# Altium schematic sheet 3-Sim Card.SchDoc
size 594 x 420 mm; SheetNumber: 3; SheetTotal: 7; PageSetup: Record=PageOptions|CenterHorizontal=False|CenterVertical=False|PrintScale=0.43|XCorrection=0.00|YCorrection=0.00|PrintKind=1|BorderSize=5000000|LeftOffset=0|BottomOffset=0|Orientation=2|PaperLength=5940|PaperWidth=4200|Scale=100|PaperSource=7|PrintQuality=-4|MediaType=1|DitherType=10|PaperKind=Personal. 1: 215,9 x 279,4 mm|PrintScaleMode=0; NumTotalFolhas: 7; NumFolha: 3
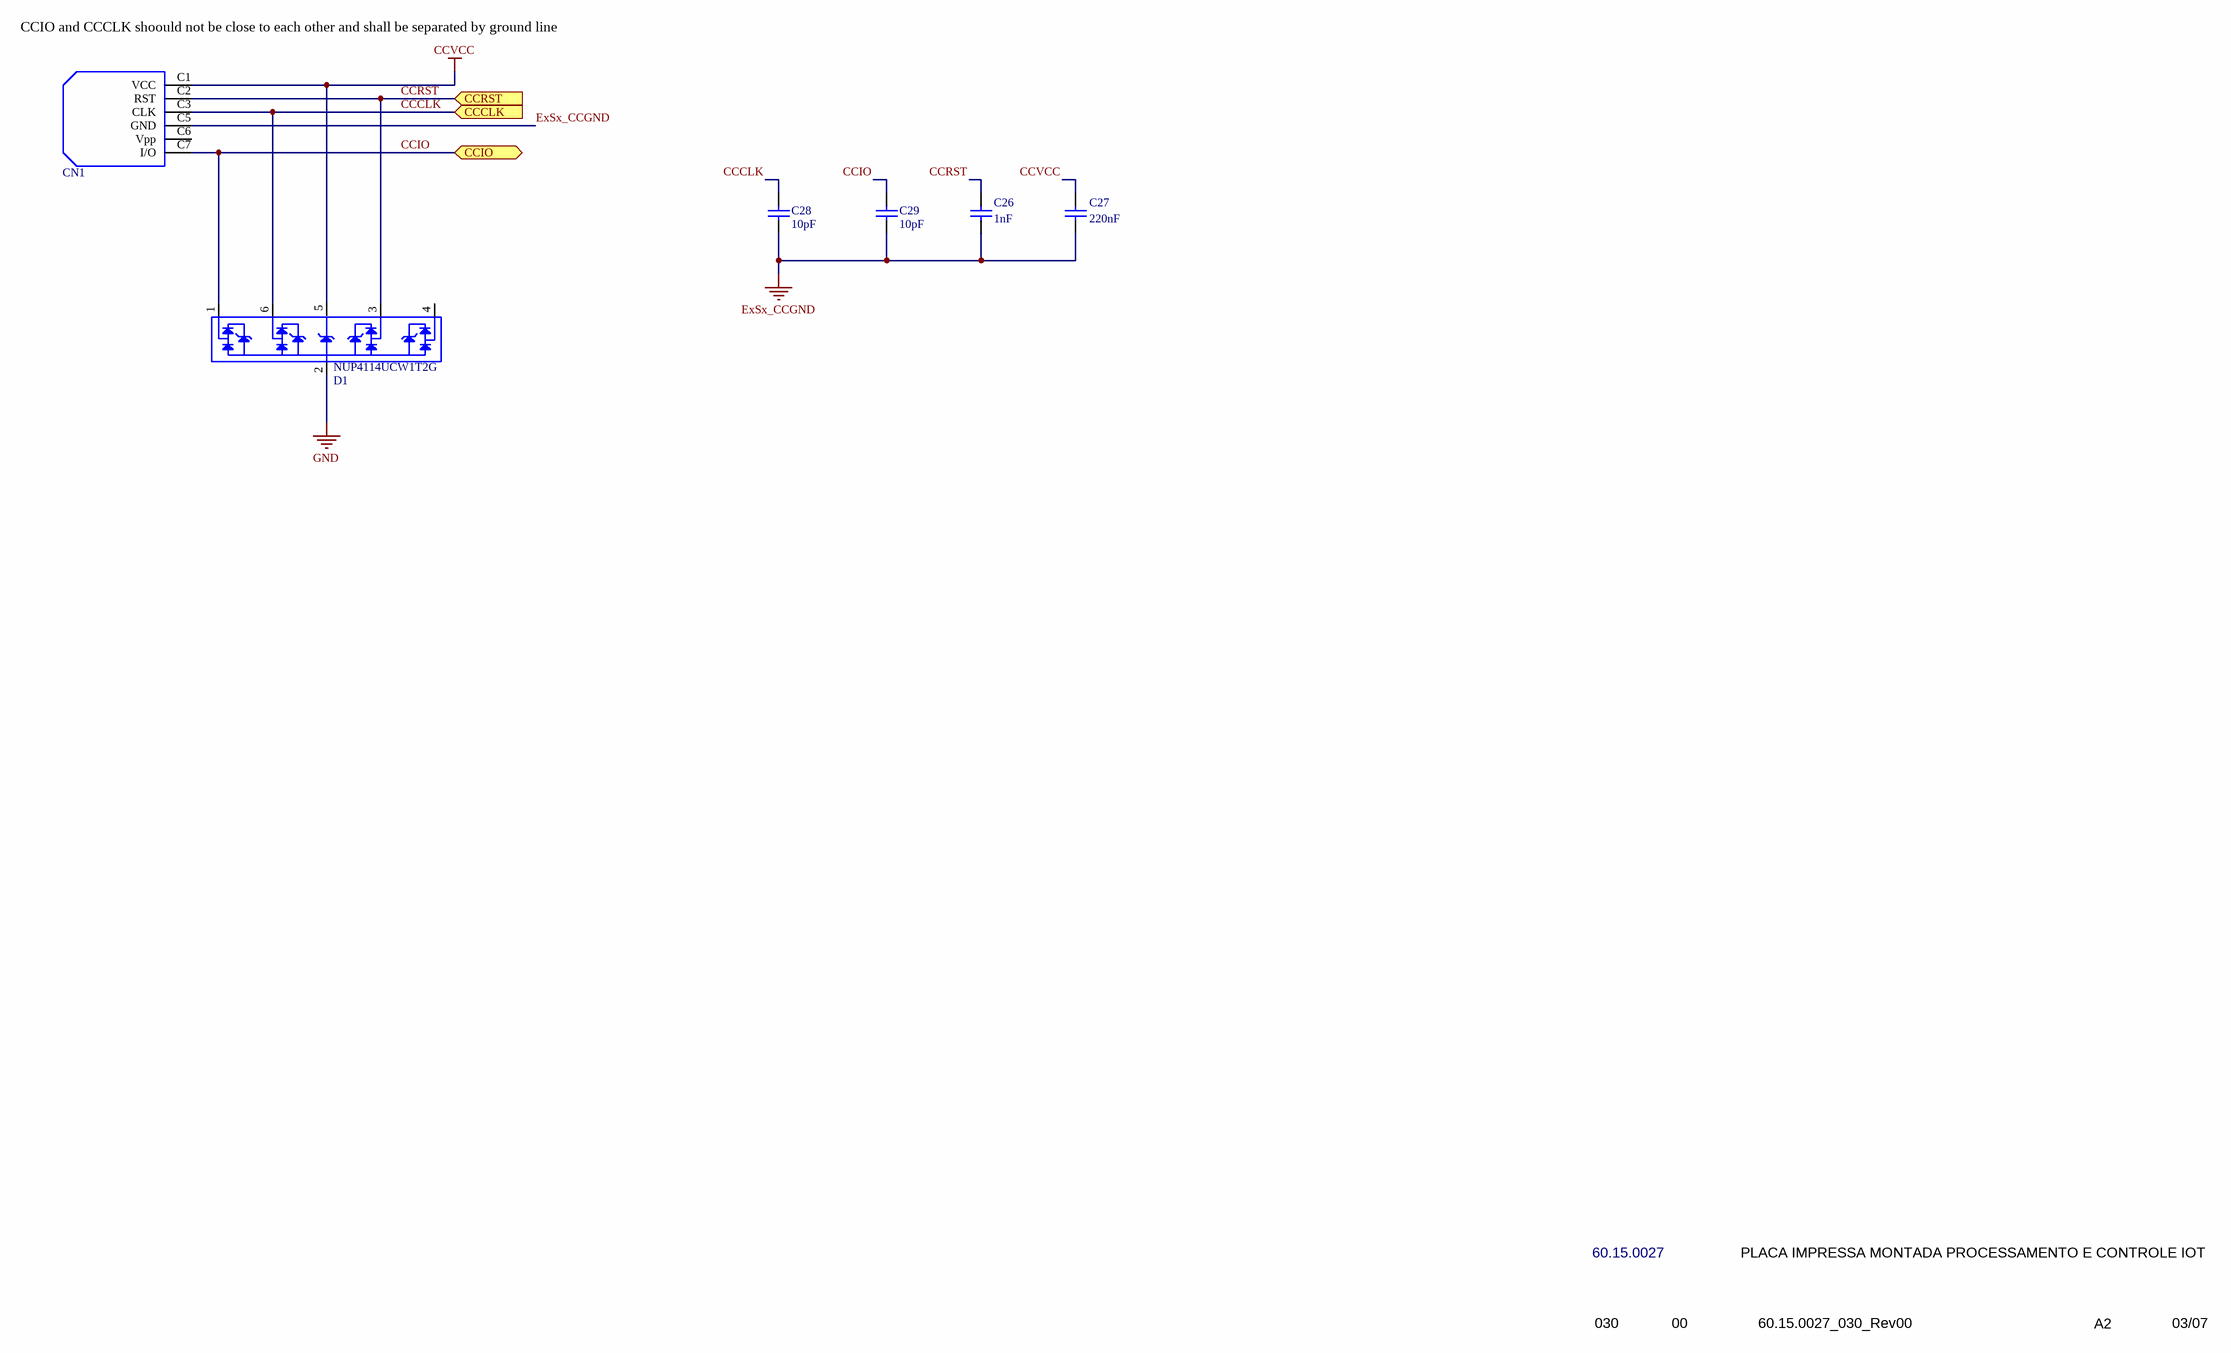
[diagram p0: 3-Sim Card.SchDoc]

## Parts
C26  16.23.0800  [16.23.0800]  (value not drawn)
C27  16.23.0801  [16.23.0801]  (value not drawn)
C28  16.23.0799  [16.23.0799]  (value not drawn)
C29  16.23.0799  [16.23.0799]  (value not drawn)
CN1  SIMCARD-6X6  [28.24.0073]  (value not drawn)
D1  32.27.0043  [32.27.0043]  (value not drawn)

## Ports
CCCLK (in), CCIO (bidir), CCRST (in)

## Nets
CCVCC: C27.2 CN1.C1(VCC) D1.5
ExSx_CCGND: C26.1 C27.1 C28.1 C29.1 CN1.C5(GND)
GND: D1.2
CCCLK: C28.2 CN1.C3(CLK) D1.6 ; port CCCLK
CCIO: C29.2 CN1.C7(I/O) D1.1 ; port CCIO
CCRST: C26.2 CN1.C2(RST) D1.3 ; port CCRST

Not connected (* = marked no-connect by the designer): CN1 C6(Vpp); D1 4

## Notes on the sheet
- (near CN1) CCIO and CCCLK shoould not be close to each other and shall be separated by ground line
- 60.15.0027
- PLACA IMPRESSA MONTADA PROCESSAMENTO E CONTROLE IOT
- 030
- 00
- 60.15.0027_030_Rev00
- A2
- 03/07
- 1
- 2
- 3
- 4
- 5
- 6
- 7
- 8
- A
- B
- C
- D
- E
- F
- G
- H
- DOCUMENTO DE ENGENHARIA DE PRODUTO
- DOCUMENT OF PRODUCT ENGINEERING
- CÓDIGO / CODE
- DESCRIÇÃO / DESCRIPTION
- DOC
- REV
- ARQUIVO / FILE
- FORM./SIZE
- FOLHA / PAGE
- (in symbol 16.23.0799) 10pF
- (in symbol 16.23.0800) 1nF
- (in symbol 16.23.0801) 220nF
- (in symbol 32.27.0043) NUP4114UCW1T2G

## Library data of the parts
C26 = 16.23.0800: CAPACITOR CERAMICO 1nF 25V 5% X7R SMD 0201
C27 = 16.23.0801: CAPACITOR CERAMICO 220nF 16V 10% X5R SMD 0201
C28 C29 = 16.23.0799: CAPACITOR CERAMICO 10pF 25V 5% C0G SMD 0201
CN1 = 28.24.0073: CONECTOR FM NANO-D 6 VIAS - BRONZE
D1 = 32.27.0043: DIODO SUPRESSOR 5.5V 10V SC88